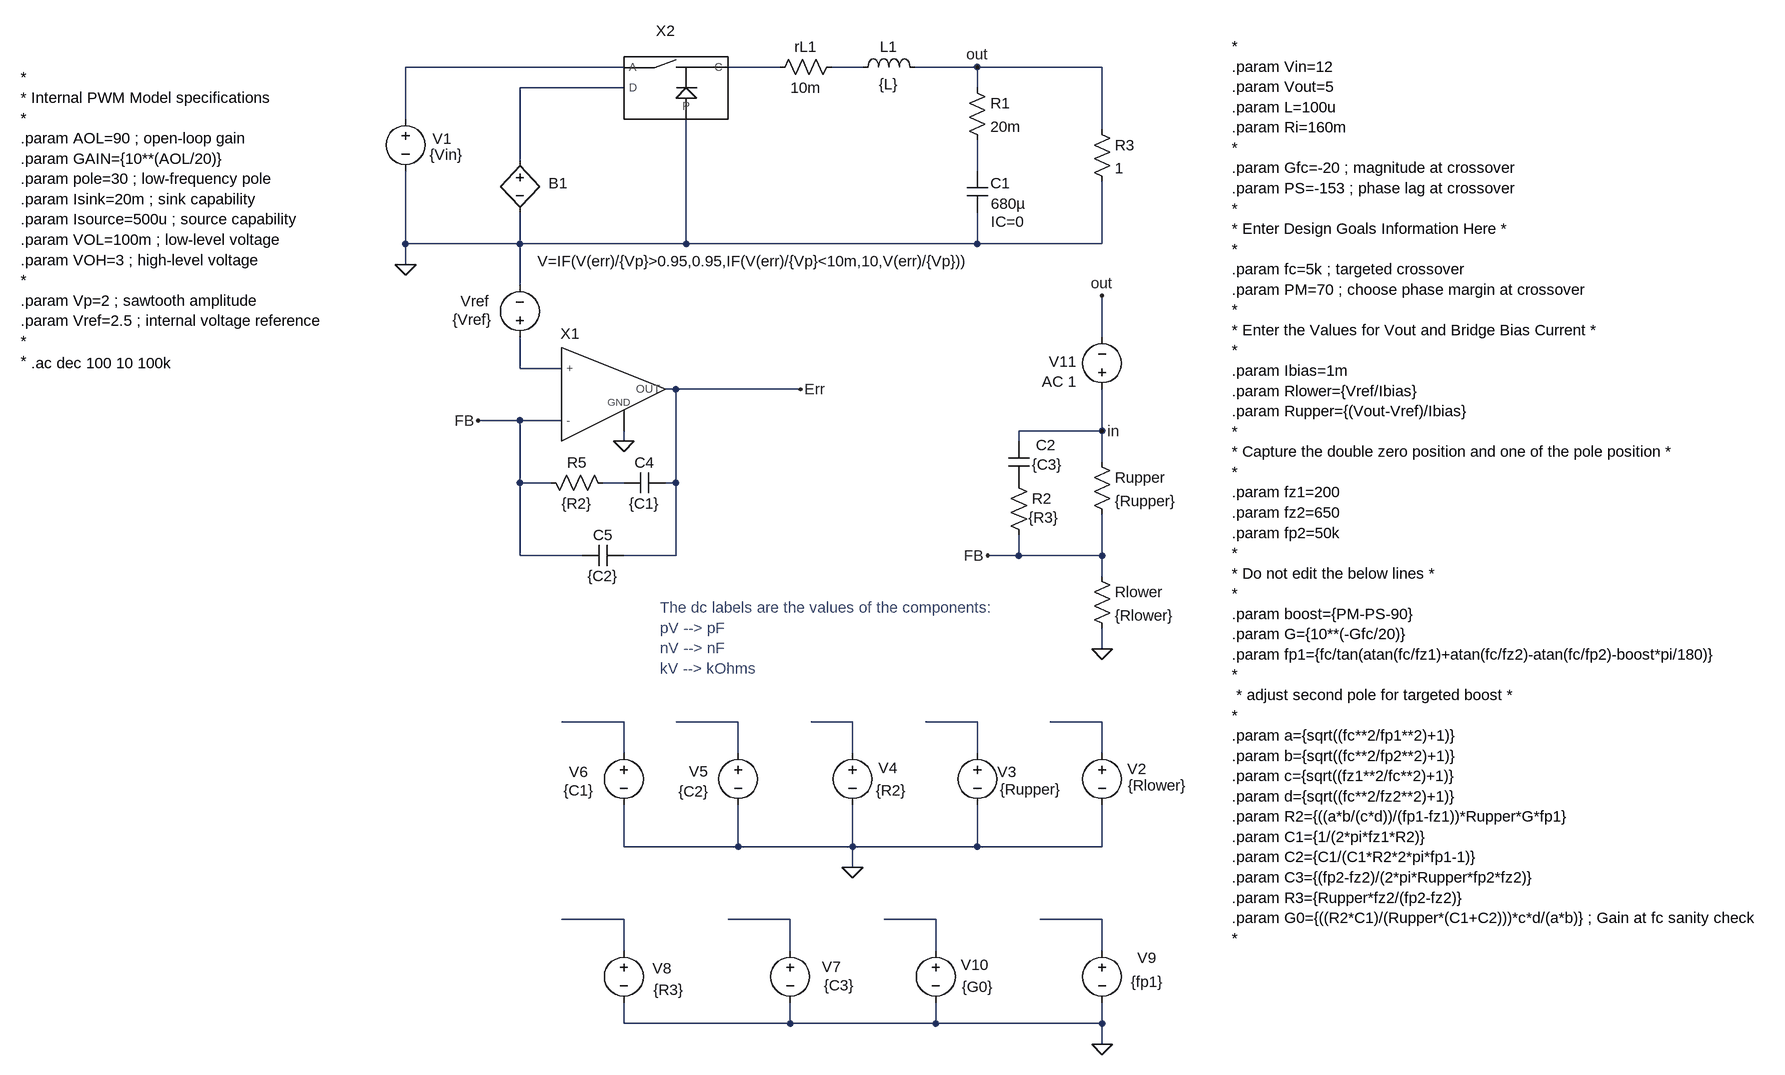
[diagram p0: schematic Buck Synchro VM - averaged.asc]
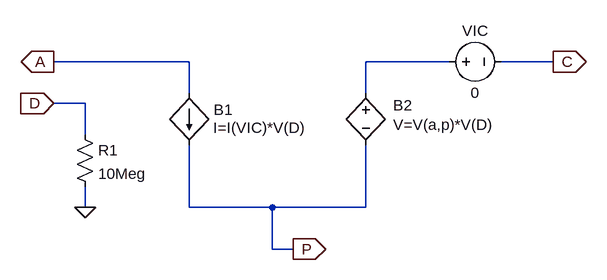
[diagram p1: sub-circuit pwmvm.asc]
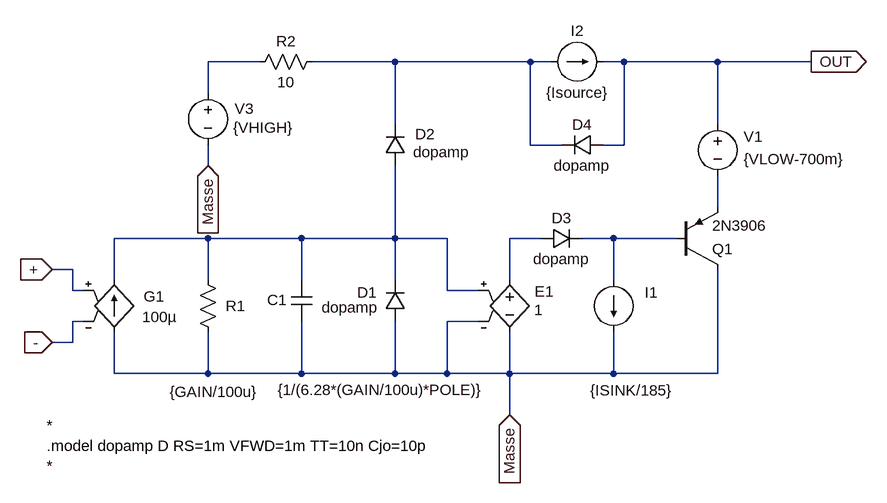
[diagram p2: sub-circuit op_amp_fan_out.asc]
Buck Synchro VM - averaged.asc, the LTspice schematic file:
Version 4.1
SHEET 1 2064 1804
WIRE 192 224 -144 224
WIRE 432 224 352 224
WIRE 560 224 512 224
WIRE 736 224 640 224
WIRE 928 224 736 224
WIRE 192 256 32 256
WIRE 736 256 736 224
WIRE -144 304 -144 224
WIRE 928 320 928 224
WIRE 32 368 32 256
WIRE 736 384 736 336
WIRE -144 496 -144 384
WIRE 32 496 32 448
WIRE 32 496 -144 496
WIRE 288 496 288 304
WIRE 288 496 32 496
WIRE 736 496 736 448
WIRE 736 496 288 496
WIRE 928 496 928 400
WIRE 928 496 736 496
WIRE -144 528 -144 496
WIRE 32 560 32 496
WIRE 928 640 928 576
WIRE 32 688 32 640
WIRE 96 688 32 688
WIRE 272 720 256 720
WIRE 464 720 272 720
WIRE 32 768 -32 768
WIRE 96 768 32 768
WIRE 928 784 928 720
WIRE 928 784 800 784
WIRE 192 800 192 784
WIRE 800 800 800 784
WIRE 928 832 928 784
WIRE 32 864 32 768
WIRE 80 864 32 864
WIRE 192 864 160 864
WIRE 272 864 272 720
WIRE 272 864 256 864
WIRE 32 976 32 864
WIRE 128 976 32 976
WIRE 272 976 272 864
WIRE 272 976 192 976
WIRE 800 976 800 944
WIRE 800 976 752 976
WIRE 928 976 928 912
WIRE 928 976 800 976
WIRE 928 1008 928 976
WIRE 928 1120 928 1088
WIRE 192 1232 96 1232
WIRE 368 1232 272 1232
WIRE 544 1232 480 1232
WIRE 736 1232 656 1232
WIRE 928 1232 848 1232
WIRE 192 1280 192 1232
WIRE 368 1280 368 1232
WIRE 544 1280 544 1232
WIRE 736 1280 736 1232
WIRE 928 1280 928 1232
WIRE 192 1424 192 1360
WIRE 368 1424 368 1360
WIRE 368 1424 192 1424
WIRE 544 1424 544 1360
WIRE 544 1424 368 1424
WIRE 736 1424 736 1360
WIRE 736 1424 544 1424
WIRE 928 1424 928 1360
WIRE 928 1424 736 1424
WIRE 544 1456 544 1424
WIRE 192 1536 96 1536
WIRE 448 1536 352 1536
WIRE 672 1536 592 1536
WIRE 928 1536 832 1536
WIRE 192 1584 192 1536
WIRE 448 1584 448 1536
WIRE 672 1584 672 1536
WIRE 928 1584 928 1536
WIRE 192 1696 192 1664
WIRE 448 1696 448 1664
WIRE 448 1696 192 1696
WIRE 672 1696 672 1664
WIRE 672 1696 448 1696
WIRE 928 1696 928 1664
WIRE 928 1696 672 1696
WIRE 928 1728 928 1696
FLAG -144 528 0
FLAG 928 1120 0
FLAG 928 576 out
FLAG 752 976 FB
FLAG 736 224 out
FLAG 544 1456 0
FLAG 928 1728 0
FLAG 192 800 0
FLAG 464 720 Err
FLAG 928 784 in
FLAG -32 768 FB
DATAFLAG 112 1232 ""
DATAFLAG 304 1232 ""
DATAFLAG 512 1232 ""
DATAFLAG 672 1232 ""
DATAFLAG 880 1232 ""
DATAFLAG 128 1536 ""
DATAFLAG 384 1536 ""
DATAFLAG 848 1536 ""
DATAFLAG 640 1536 ""
DATAFLAG 928 224 ""
DATAFLAG 96 256 ""
DATAFLAG 368 720 ""
SYMBOL voltage -144 288 R0
WINDOW 0 42 46 Left 2
WINDOW 3 37 71 Left 2
SYMATTR InstName V1
SYMATTR Value {Vin}
SYMBOL res 528 208 R90
WINDOW 0 0 56 VBottom 2
WINDOW 3 32 56 VTop 2
SYMATTR InstName rL1
SYMATTR Value 10m
SYMBOL ind 544 240 R270
WINDOW 0 32 56 VTop 2
WINDOW 3 5 56 VBottom 2
SYMATTR InstName L1
SYMATTR Value {L}
SYMBOL res 720 240 R0
SYMATTR InstName R1
SYMATTR Value 20m
SYMBOL cap 720 384 R0
WINDOW 0 36 19 Left 2
WINDOW 3 37 50 Left 2
WINDOW 123 37 78 Left 2
SYMATTR InstName C1
SYMATTR Value 680µ
SYMATTR Value2 IC=0
SYMBOL res 912 304 R0
SYMATTR InstName R3
SYMATTR Value 1
SYMBOL res 912 992 R0
SYMATTR InstName Rlower
SYMATTR Value {Rlower}
SYMBOL res 912 816 R0
SYMATTR InstName Rupper
SYMATTR Value {Rupper}
SYMBOL cap 784 800 R0
WINDOW 0 42 6 Left 2
WINDOW 3 36 36 Left 2
SYMATTR InstName C2
SYMATTR Value {C3}
SYMBOL res 784 848 R0
WINDOW 3 31 69 Left 2
SYMATTR Value {R3}
SYMATTR InstName R2
SYMBOL cap 192 848 M90
WINDOW 0 0 32 VBottom 2
WINDOW 3 32 32 VTop 2
SYMATTR InstName C4
SYMATTR Value {C1}
SYMBOL res 64 848 M90
WINDOW 0 0 56 VBottom 2
WINDOW 3 32 56 VTop 2
SYMATTR InstName R5
SYMATTR Value {R2}
SYMBOL cap 128 960 M90
WINDOW 0 0 32 VBottom 2
WINDOW 3 32 32 VTop 2
SYMATTR InstName C5
SYMATTR Value {C2}
SYMBOL voltage 928 1264 R0
WINDOW 0 39 40 Left 2
WINDOW 3 40 66 Left 2
WINDOW 123 0 0 Left 0
WINDOW 39 0 0 Left 0
SYMATTR InstName V2
SYMATTR Value {Rlower}
SYMBOL voltage 736 1264 R0
WINDOW 0 31 45 Left 2
WINDOW 3 35 72 Left 2
WINDOW 123 0 0 Left 0
WINDOW 39 0 0 Left 0
SYMATTR InstName V3
SYMATTR Value {Rupper}
SYMBOL voltage 544 1264 R0
WINDOW 0 40 39 Left 2
WINDOW 3 36 73 Left 2
WINDOW 123 0 0 Left 0
WINDOW 39 0 0 Left 0
SYMATTR InstName V4
SYMATTR Value {R2}
SYMBOL voltage 368 1264 R0
WINDOW 0 -76 44 Left 2
WINDOW 3 -92 75 Left 2
SYMATTR InstName V5
SYMATTR Value {C2}
SYMBOL voltage 192 1264 R0
WINDOW 0 -84 45 Left 2
WINDOW 3 -93 73 Left 2
WINDOW 123 0 0 Left 0
WINDOW 39 0 0 Left 0
SYMATTR InstName V6
SYMATTR Value {C1}
SYMBOL voltage 448 1568 R0
WINDOW 0 49 41 Left 2
WINDOW 3 52 69 Left 2
SYMATTR InstName V7
SYMATTR Value {C3}
SYMBOL voltage 192 1568 R0
WINDOW 0 44 43 Left 2
WINDOW 3 46 76 Left 2
SYMATTR InstName V8
SYMATTR Value {R3}
SYMBOL voltage 928 1568 R0
WINDOW 0 54 27 Left 2
WINDOW 3 44 64 Left 2
WINDOW 123 0 0 Left 0
WINDOW 39 0 0 Left 0
SYMATTR InstName V9
SYMATTR Value {fp1}
SYMBOL voltage 672 1568 R0
WINDOW 0 39 38 Left 2
WINDOW 3 40 72 Left 2
SYMATTR InstName V10
SYMATTR Value {G0}
SYMBOL TOF\\Subcircuits\\PWMVM 256 240 R0
SYMATTR InstName X2
SYMBOL bv 32 352 R0
WINDOW 0 44 51 Left 2
WINDOW 3 27 171 Left 2
SYMATTR InstName B1
SYMATTR Value V=IF(V(err)/{Vp}>0.95,0.95,IF(V(err)/{Vp}<10m,10,V(err)/{Vp}))
SYMBOL op_amp_fan_out 176 720 R0
WINDOW 0 -67 -70 Bottom 2
SYMATTR InstName X1
SYMATTR SpiceLine gain={gain} pole={pole} Isink={Isink} Isource={Isource} Vlow={VOL} Vhigh={VOH}
SYMBOL voltage 32 656 R180
WINDOW 0 47 72 Left 2
WINDOW 3 43 43 Left 2
SYMATTR InstName Vref
SYMATTR Value {Vref}
SYMBOL voltage 928 736 R180
WINDOW 0 39 59 Left 2
WINDOW 3 24 16 Left 2
WINDOW 123 39 28 Left 2
WINDOW 39 0 0 Left 0
SYMATTR InstName V11
SYMATTR Value ""
SYMATTR Value2 AC 1
TEXT 1128 192 Left 2 !*\n.param Vin=12\n.param Vout=5\n.param L=100u\n.param Ri=160m\n*\n.param Gfc=-20 ; magnitude at crossover\n.param PS=-153 ; phase lag at crossover\n*\n* Enter Design Goals Information Here *\n*\n.param fc=5k ; targeted crossover\n.param PM=70 ; choose phase margin at crossover\n*\n* Enter the Values for Vout and Bridge Bias Current *\n*\n.param Ibias=1m\n.param Rlower={Vref/Ibias}\n.param Rupper={(Vout-Vref)/Ibias}\n*\n* Capture the double zero position and one of the pole position *\n*\n.param fz1=200\n.param fz2=650\n.param fp2=50k\n*\n* Do not edit the below lines *\n*\n.param boost={PM-PS-90}\n.param G={10**(-Gfc/20)}\n.param fp1={fc/tan(atan(fc/fz1)+atan(fc/fz2)-atan(fc/fp2)-boost*pi/180)}\n*\n * adjust second pole for targeted boost *\n*\n.param a={sqrt((fc**2/fp1**2)+1)}\n.param b={sqrt((fc**2/fp2**2)+1)}\n.param c={sqrt((fz1**2/fc**2)+1)}\n.param d={sqrt((fc**2/fz2**2)+1)}\n.param R2={((a*b/(c*d))/(fp1-fz1))*Rupper*G*fp1}\n.param C1={1/(2*pi*fz1*R2)}\n.param C2={C1/(C1*R2*2*pi*fp1-1)}\n.param C3={(fp2-fz2)/(2*pi*Rupper*fp2*fz2)}\n.param R3={Rupper*fz2/(fp2-fz2)}\n.param G0={((R2*C1)/(Rupper*(C1+C2)))*c*d/(a*b)} ; Gain at fc sanity check\n*
TEXT 248 1056 Left 2 ;The dc labels are the values of the components:\npV --> pF\nnV --> nF\nkV --> kOhms
TEXT -736 240 Left 2 !*\n* Internal PWM Model specifications\n*\n.param AOL=90 ; open-loop gain \n.param GAIN={10**(AOL/20)}\n.param pole=30 ; low-frequency pole\n.param Isink=20m ; sink capability\n.param Isource=500u ; source capability\n.param VOL=100m ; low-level voltage\n.param VOH=3 ; high-level voltage\n*\n.param Vp=2 ; sawtooth amplitude\n.param Vref=2.5 ; internal voltage reference\n*\n*
TEXT -720 680 Left 2 !.ac dec 100 10 100k

pwmvm.asc, the sub-circuit schematic file:
Version 4
SHEET 1 880 680
WIRE 64 48 -144 48
WIRE 464 48 336 48
WIRE 624 48 544 48
WIRE 64 96 64 48
WIRE 336 96 336 48
WIRE -96 112 -144 112
WIRE -96 160 -96 112
WIRE -96 272 -96 240
WIRE 64 272 64 176
WIRE 192 272 64 272
WIRE 336 272 336 176
WIRE 336 272 192 272
WIRE 192 336 192 272
WIRE 224 336 192 336
FLAG -96 272 0
FLAG -144 48 A
IOPIN -144 48 Out
FLAG 624 48 C
IOPIN 624 48 Out
FLAG 224 336 P
IOPIN 224 336 Out
FLAG -144 112 D
IOPIN -144 112 In
SYMBOL bi 64 96 R0
WINDOW 0 38 26 Left 2
WINDOW 3 37 53 Left 2
SYMATTR InstName B1
SYMATTR Value I=I(VIC)*V(D)
SYMBOL bv 336 80 R0
WINDOW 0 42 35 Left 2
WINDOW 3 42 65 Left 2
SYMATTR InstName B2
SYMATTR Value V=V(a,p)*V(D)
SYMBOL voltage 448 48 R270
WINDOW 0 32 56 VTop 2
WINDOW 3 -32 56 VBottom 2
WINDOW 123 0 0 Left 0
WINDOW 39 0 0 Left 0
SYMATTR InstName VIC
SYMATTR Value 0
SYMBOL res -112 144 R0
SYMATTR InstName R1
SYMATTR Value 10Meg

op_amp_fan_out.asc, the sub-circuit schematic file:
Version 4.1
SHEET 1 1504 680
WIRE 96 -224 16 -224
WIRE 304 -224 176 -224
WIRE 512 -224 304 -224
WIRE 544 -224 512 -224
WIRE 656 -224 624 -224
WIRE 800 -224 656 -224
WIRE 944 -224 800 -224
WIRE 16 -176 16 -224
WIRE 304 -128 304 -224
WIRE 800 -128 800 -224
WIRE 512 -96 512 -224
WIRE 560 -96 512 -96
WIRE 656 -96 656 -224
WIRE 656 -96 624 -96
WIRE 16 -64 16 -96
WIRE 800 0 800 -48
WIRE 16 48 -128 48
WIRE 160 48 16 48
WIRE 304 48 304 -64
WIRE 304 48 160 48
WIRE 384 48 304 48
WIRE 528 48 480 48
WIRE 640 48 592 48
WIRE 736 48 640 48
WIRE -192 96 -224 96
WIRE -128 112 -128 48
WIRE 16 112 16 48
WIRE 160 112 160 48
WIRE 304 112 304 48
WIRE 480 112 480 48
WIRE 640 112 640 48
WIRE -192 128 -192 96
WIRE -176 128 -192 128
WIRE 384 128 384 48
WIRE 432 128 384 128
WIRE -176 176 -192 176
WIRE 432 176 384 176
WIRE -192 208 -192 176
WIRE -192 208 -224 208
WIRE -128 256 -128 192
WIRE 16 256 16 192
WIRE 16 256 -128 256
WIRE 160 256 160 176
WIRE 160 256 16 256
WIRE 304 256 304 176
WIRE 304 256 160 256
WIRE 384 256 384 176
WIRE 384 256 304 256
WIRE 480 256 480 192
WIRE 480 256 384 256
WIRE 640 256 640 192
WIRE 640 256 480 256
WIRE 800 256 800 96
WIRE 800 256 640 256
WIRE 480 320 480 256
FLAG -224 96 +
IOPIN -224 96 In
FLAG -224 208 -
IOPIN -224 208 In
FLAG 944 -224 OUT
IOPIN 944 -224 Out
FLAG 480 320 Masse
IOPIN 480 320 In
FLAG 16 -64 Masse
IOPIN 16 -64 In
DATAFLAG 800 -16 ""
SYMBOL g -128 96 R0
WINDOW 0 45 41 Left 2
WINDOW 3 43 73 Left 2
SYMATTR InstName G1
SYMATTR Value 100µ
SYMBOL res 0 96 R0
WINDOW 0 43 56 Left 2
WINDOW 3 -43 188 Left 2
SYMATTR InstName R1
SYMATTR Value {GAIN/100u}
SYMBOL cap 144 112 R0
WINDOW 0 -37 31 Left 2
WINDOW 3 -21 169 Left 2
SYMATTR InstName C1
SYMATTR Value {1/(6.28*(GAIN/100u)*POLE)}
SYMBOL diode 320 176 R180
WINDOW 0 44 45 Left 2
WINDOW 3 41 22 Left 2
SYMATTR InstName D1
SYMATTR Value dopamp
SYMBOL e 480 96 R0
WINDOW 0 39 34 Left 2
WINDOW 3 38 62 Left 2
SYMATTR InstName E1
SYMATTR Value 1
SYMBOL diode 528 64 R270
WINDOW 0 32 32 VTop 2
WINDOW 3 0 32 VBottom 2
SYMATTR InstName D3
SYMATTR Value dopamp
SYMBOL current 640 112 R0
WINDOW 0 48 19 Left 2
WINDOW 3 -36 170 Left 2
SYMATTR InstName I1
SYMATTR Value {ISINK/185}
SYMBOL pnp 736 96 M180
SYMATTR InstName Q1
SYMATTR Value 2N3906
SYMBOL voltage 800 -144 R0
WINDOW 0 40 35 Left 2
WINDOW 3 40 70 Left 2
SYMATTR InstName V1
SYMATTR Value {VLOW-700m}
SYMBOL current 544 -224 R270
WINDOW 0 32 40 VTop 2
WINDOW 3 -32 40 VBottom 2
SYMATTR InstName I2
SYMATTR Value {Isource}
SYMBOL diode 624 -80 M270
WINDOW 0 32 32 VTop 2
WINDOW 3 0 32 VBottom 2
SYMATTR InstName D4
SYMATTR Value dopamp
SYMBOL voltage 16 -192 R0
WINDOW 0 41 40 Left 2
WINDOW 3 39 69 Left 2
SYMATTR InstName V3
SYMATTR Value {VHIGH}
SYMBOL diode 288 -64 M180
WINDOW 0 47 49 Left 2
WINDOW 3 44 21 Left 2
SYMATTR InstName D2
SYMATTR Value dopamp
SYMBOL res 192 -240 R90
WINDOW 0 0 56 VBottom 2
WINDOW 3 32 56 VTop 2
SYMATTR InstName R2
SYMATTR Value 10
TEXT -232 336 Left 2 !*\n.model dopamp D RS=1m VFWD=1m TT=10n Cjo=10p\n*

The netlist it stands for:
* Buck Synchro VM - averaged.asc
V1 N001 0 {Vin}
rL1 N003 N002 10m
L1 N003 out {L}
R1 out N005 20m
C1 N005 0 680µ IC=0
R3 out 0 1
Rlower FB 0 {Rlower}
Rupper in FB {Rupper}
C2 in P001 {C3}
R2 P001 FB {R3}
C4 N007 Err {C1}
R5 FB N007 {R2}
C5 FB Err {C2}
V2 N012 0 {Rlower}
V3 N011 0 {Rupper}
V4 N010 0 {R2}
V5 N009 0 {C2}
V6 N008 0 {C1}
V7 N014 0 {C3}
V8 N013 0 {R3}
V9 N016 0 {fp1}
V10 N015 0 {G0}
X§X2 N004 N001 N002 0 pwmvm
B1 N004 0 V=IF(V(err)/{Vp}>0.95,0.95,IF(V(err)/{Vp}<10m,10,V(err)/{Vp}))
X§X1 N006 FB 0 Err op_amp_fan_out params: gain={gain} pole={pole} Isink={Isink} Isource={Isource} Vlow={VOL} Vhigh={VOH}
Vref N006 0 {Vref}
V11 in out AC 1

* block symbol definitions
.subckt pwmvm D A C P
B1 A P I=I(VIC)*V(D)
B2 N001 P V=V(a,p)*V(D)
VIC N001 C 0
R1 D 0 10Meg
.ends pwmvm

.subckt op_amp_fan_out + - Masse OUT
G1 Masse N004 + - 100µ
R1 N004 Masse {GAIN/100u}
C1 N004 Masse {1/(6.28*(GAIN/100u)*POLE)}
D1 Masse N004 dopamp
E1 N005 Masse N004 Masse 1
D3 N005 N006 dopamp
I1 N006 Masse {ISINK/185}
Q1 Masse N006 N003 0 2N3906
V1 OUT N003 {VLOW-700m}
I2 N002 OUT {Isource}
D4 OUT N002 dopamp
V3 N001 Masse {VHIGH}
D2 N004 N002 dopamp
R2 N002 N001 10
*
.model dopamp D RS=1m VFWD=1m TT=10n Cjo=10p
*
.ends op_amp_fan_out

.model D D
.lib standard.dio
.model NPN NPN
.model PNP PNP
.lib standard.bjt
*
.param Vin=12
.param Vout=5
.param L=100u
.param Ri=160m
*
.param Gfc=-20 ; magnitude at crossover
.param PS=-153 ; phase lag at crossover
*
* Enter Design Goals Information Here *
*
.param fc=5k ; targeted crossover
.param PM=70 ; choose phase margin at crossover
*
* Enter the Values for Vout and Bridge Bias Current *
*
.param Ibias=1m
.param Rlower={Vref/Ibias}
.param Rupper={(Vout-Vref)/Ibias}
*
* Capture the double zero position and one of the pole position *
*
.param fz1=200
.param fz2=650
.param fp2=50k
*
* Do not edit the below lines *
*
.param boost={PM-PS-90}
.param G={10**(-Gfc/20)}
.param fp1={fc/tan(atan(fc/fz1)+atan(fc/fz2)-atan(fc/fp2)-boost*pi/180)}
*
 * adjust second pole for targeted boost *
*
.param a={sqrt((fc**2/fp1**2)+1)}
.param b={sqrt((fc**2/fp2**2)+1)}
.param c={sqrt((fz1**2/fc**2)+1)}
.param d={sqrt((fc**2/fz2**2)+1)}
.param R2={((a*b/(c*d))/(fp1-fz1))*Rupper*G*fp1}
.param C1={1/(2*pi*fz1*R2)}
.param C2={C1/(C1*R2*2*pi*fp1-1)}
.param C3={(fp2-fz2)/(2*pi*Rupper*fp2*fz2)}
.param R3={Rupper*fz2/(fp2-fz2)}
.param G0={((R2*C1)/(Rupper*(C1+C2)))*c*d/(a*b)} ; Gain at fc sanity check
*
* The dc labels are the values of the components:
* pV --> pF
* nV --> nF
* kV --> kOhms
*
* Internal PWM Model specifications
*
.param AOL=90 ; open-loop gain
.param GAIN={10**(AOL/20)}
.param pole=30 ; low-frequency pole
.param Isink=20m ; sink capability
.param Isource=500u ; source capability
.param VOL=100m ; low-level voltage
.param VOH=3 ; high-level voltage
*
.param Vp=2 ; sawtooth amplitude
.param Vref=2.5 ; internal voltage reference
*
*
.ac dec 100 10 100k
.backanno
.end